# EasyEDA schematic KegWasher_1.1_Schematic.EasyEDA.json
TITLE: Keg Washer Pi Hat; REV: 1.1; Date: 2020-05-07; Sheet: 1/1; Drawn By: Kyle Hultman; Company: Kyle Hultman
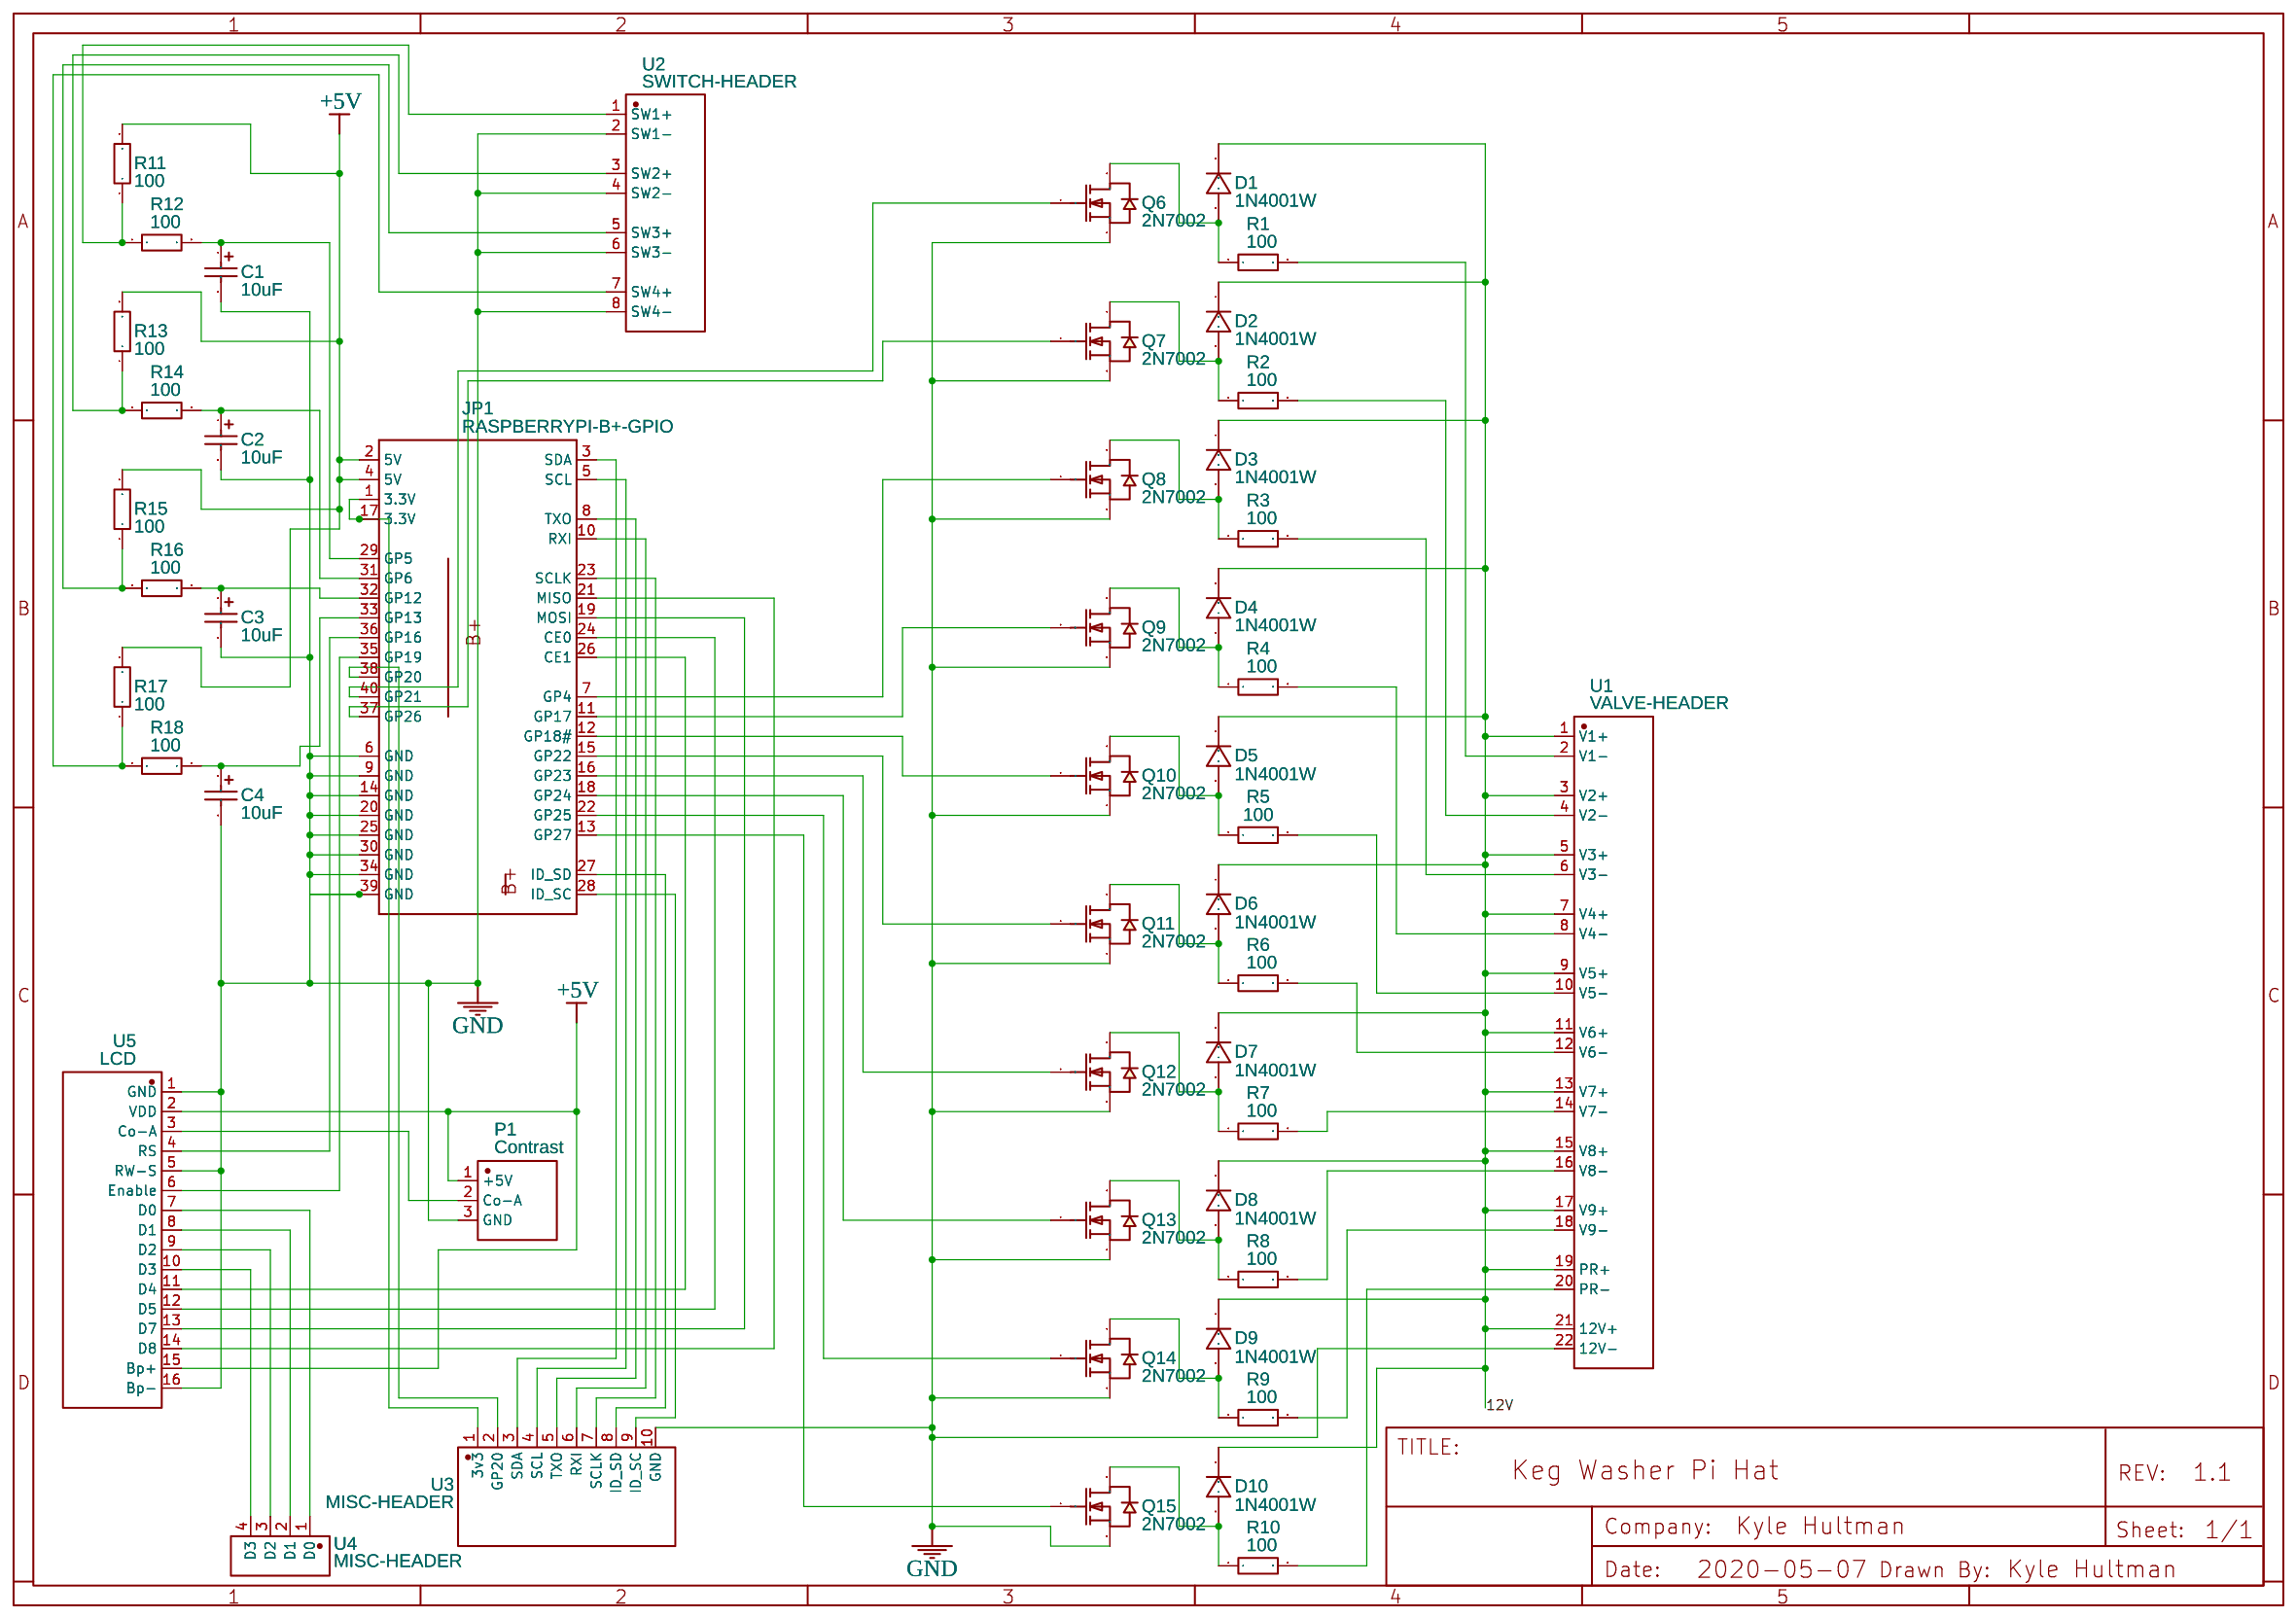
[diagram p0: schematic sheet]

## Parts
C1  10uF  [CAP-SMD_L3.2-W1.6-R-RD]
C2  10uF  [CAP-SMD_L3.2-W1.6-R-RD]
C3  10uF  [CAP-SMD_L3.2-W1.6-R-RD]
C4  10uF  [CAP-SMD_L3.2-W1.6-R-RD]
D1  1N4001W  [SOD-123F_L2.8-W1.8-LS3.7-RD]
D2  1N4001W  [SOD-123F_L2.8-W1.8-LS3.7-RD]
D3  1N4001W  [SOD-123F_L2.8-W1.8-LS3.7-RD]
D4  1N4001W  [SOD-123F_L2.8-W1.8-LS3.7-RD]
D5  1N4001W  [SOD-123F_L2.8-W1.8-LS3.7-RD]
D6  1N4001W  [SOD-123F_L2.8-W1.8-LS3.7-RD]
D7  1N4001W  [SOD-123F_L2.8-W1.8-LS3.7-RD]
D8  1N4001W  [SOD-123F_L2.8-W1.8-LS3.7-RD]
D9  1N4001W  [SOD-123F_L2.8-W1.8-LS3.7-RD]
D10  1N4001W  [SOD-123F_L2.8-W1.8-LS3.7-RD]
JP1  RASPBERRYPI-B+-GPIO  [2X20-SHROUDED]
P1  Contrast  [POTENTIOMETER_WIREPADS_SMALL]
Q6  2N7002  [SOT-23-3_L2.9-W1.3-P1.90-LS2.4-BR]
Q7  2N7002  [SOT-23-3_L2.9-W1.3-P1.90-LS2.4-BR]
Q8  2N7002  [SOT-23-3_L2.9-W1.3-P1.90-LS2.4-BR]
Q9  2N7002  [SOT-23-3_L2.9-W1.3-P1.90-LS2.4-BR]
Q10  2N7002  [SOT-23-3_L2.9-W1.3-P1.90-LS2.4-BR]
Q11  2N7002  [SOT-23-3_L2.9-W1.3-P1.90-LS2.4-BR]
Q12  2N7002  [SOT-23-3_L2.9-W1.3-P1.90-LS2.4-BR]
Q13  2N7002  [SOT-23-3_L2.9-W1.3-P1.90-LS2.4-BR]
Q14  2N7002  [SOT-23-3_L2.9-W1.3-P1.90-LS2.4-BR]
Q15  2N7002  [SOT-23-3_L2.9-W1.3-P1.90-LS2.4-BR]
R1  100  [R0805]
R2  100  [R0805]
R3  100  [R0805]
R4  100  [R0805]
R5  100  [R0805]
R6  100  [R0805]
R7  100  [R0805]
R8  100  [R0805]
R9  100  [R0805]
R10  100  [R0805]
R11  100  [R0805]
R12  100  [R0805]
R13  100  [R0805]
R14  100  [R0805]
R15  100  [R0805]
R16  100  [R0805]
R17  100  [R0805]
R18  100  [R0805]
U1  VALVE-HEADER  [PIN_HEADER_STRAIGHT_1X22_PITCH2.54MM]
U2  SWITCH-HEADER  [HDR-M-2.54_1X8]
U3  MISC-HEADER  [HDR-M-2.54_1X10]
U4  MISC-HEADER  [HDR-M-2.54_1X4]
U5  LCD  [HDR-M-2.54_1X16]

## Library data of the parts
C1-C4 = TAJA106K016RNJ: Supplier: LCSC; Manufacturer: AVX; LCSC Assembly: Yes; Supplier Part: C7171; SMT Type: Basic
D1-D10 = 1N4001W: Supplier Part: C162732; Supplier: LCSC; Manufacturer: Jingdao; Contributor: LCSC; LCSC Assembly: Yes; SMT Type: Extend
JP1 = RASPBERRYPI-B+-GPIO: Raspberry Pi B+ GPIO Header; Contributor: SparkFun
P1 = Contrast
Q6-Q15 = 2N7002: Supplier: LCSC; Manufacturer: CJ; LCSC Assembly: Yes; image: //image.lceda.cn/szlcsc/C8545.jpg; Supplier Part: C8545; SMT Type: Basic
R1-R18 = 0805W8F1000T5E: Supplier: LCSC; Manufacturer: UniOhm; LCSC Assembly: Yes; Supplier Part: C17408; SMT Type: Basic
U1 = VALVE-HEADER
U2 = SWITCH-HEADER
U3 U4 = MISC-HEADER
U5 = LCD

## Nets
12V: D1.1(C) D2.1(C) D3.1(C) D4.1(C) D5.1(C) D6.1(C) D7.1(C) D8.1(C) D9.1(C) D10.1(C) U1.1(V1+) U1.3(V2+) U1.5(V3+) U1.7(V4+) U1.9(V5+) U1.11(V6+) U1.13(V7+) U1.15(V8+) U1.17(V9+) U1.19(PR+) U1.21(12V+)
+5V: JP1.2(5V) JP1.4(5V) P1.1(+5V) R11.2 R13.2 R15.2 R17.2 U5.2(VDD) U5.15(Bp+)
GND: C1.2 C2.2 C3.2 C4.2 JP1.6(GND) JP1.9(GND) JP1.14(GND) JP1.20(GND) JP1.25(GND) JP1.30(GND) JP1.34(GND) JP1.39(GND) P1.3(GND) Q6.2(S) Q7.2(S) Q8.2(S) Q9.2(S) Q10.2(S) Q11.2(S) Q12.2(S) Q13.2(S) Q14.2(S) Q15.2(S) U1.22(12V-) U2.2(SW1-) U2.4(SW2-) U2.6(SW3-) U2.8(SW4-) U3.10(GND) U5.1(GND) U5.5(RW-S) U5.16(Bp-)
Net-(C1-1): C1.1 JP1.29(GP5) R12.2
Net-(C2-1): C2.1 JP1.31(GP6) R14.2
Net-(C3-1): C3.1 JP1.32(GP12) R16.2
Net-(C4-1): C4.1 JP1.33(GP13) R18.2
Net-(D1-2): D1.2(A) Q6.3(D) R1.1
Net-(D2-2): D2.2(A) Q7.3(D) R2.1
Net-(D3-2): D3.2(A) Q8.3(D) R3.1
Net-(D4-2): D4.2(A) Q9.3(D) R4.1
Net-(D5-2): D5.2(A) Q10.3(D) R5.1
Net-(D6-2): D6.2(A) Q11.3(D) R6.1
Net-(D7-2): D7.2(A) Q12.3(D) R7.1
Net-(D8-2): D8.2(A) Q13.3(D) R8.1
Net-(D9-2): D9.2(A) Q14.3(D) R9.1
Net-(D10-2): D10.2(A) Q15.3(D) R10.1
Net-(JP1-1): JP1.1(3.3V) JP1.17(3.3V) U3.1(3v3)
Net-(JP1-3): JP1.3(SDA) U3.3(SDA)
Net-(JP1-5): JP1.5(SCL) U3.4(SCL)
Net-(JP1-7): JP1.7(GP4) Q8.1(G)
Net-(JP1-8): JP1.8(TXO) U3.5(TXO)
Net-(JP1-10): JP1.10(RXI) U3.6(RXI)
Net-(JP1-11): JP1.11(GP17) Q9.1(G)
Net-(JP1-12): JP1.12(GP18#) Q10.1(G)
Net-(JP1-13): JP1.13(GP27) Q15.1(G)
Net-(JP1-15): JP1.15(GP22) Q11.1(G)
Net-(JP1-16): JP1.16(GP23) Q12.1(G)
Net-(JP1-18): JP1.18(GP24) Q13.1(G)
Net-(JP1-19): JP1.19(MOSI) U5.13(D7)
Net-(JP1-21): JP1.21(MISO) U5.14(D8)
Net-(JP1-22): JP1.22(GP25) Q14.1(G)
Net-(JP1-23): JP1.23(SCLK) U3.7(SCLK)
Net-(JP1-24): JP1.24(CE0) U5.12(D5)
Net-(JP1-26): JP1.26(CE1) U5.11(D4)
Net-(JP1-27): JP1.27(ID_SD) U3.8(ID_SD)
Net-(JP1-28): JP1.28(ID_SC) U3.9(ID_SC)
Net-(JP1-35): JP1.35(GP19) U5.6(Enable)
Net-(JP1-36): JP1.36(GP16) U5.4(RS)
Net-(JP1-37): JP1.37(GP26) Q7.1(G)
Net-(JP1-38): JP1.38(GP20) U3.2(GP20)
Net-(JP1-40): JP1.40(GP21) Q6.1(G)
Net-(P1-2): P1.2(Co-A) U5.3(Co-A)
Net-(R1-2): R1.2 U1.2(V1-)
Net-(R2-2): R2.2 U1.4(V2-)
Net-(R3-2): R3.2 U1.6(V3-)
Net-(R4-2): R4.2 U1.8(V4-)
Net-(R5-2): R5.2 U1.10(V5-)
Net-(R6-2): R6.2 U1.12(V6-)
Net-(R7-2): R7.2 U1.14(V7-)
Net-(R8-2): R8.2 U1.16(V8-)
Net-(R9-2): R9.2 U1.18(V9-)
Net-(R10-2): R10.2 U1.20(PR-)
Net-(R11-1): R11.1 R12.1 U2.1(SW1+)
Net-(R13-1): R13.1 R14.1 U2.3(SW2+)
Net-(R15-1): R15.1 R16.1 U2.5(SW3+)
Net-(R17-1): R17.1 R18.1 U2.7(SW4+)
Net-(U4-1): U4.1(D0) U5.7(D0)
Net-(U4-2): U4.2(D1) U5.8(D1)
Net-(U4-3): U4.3(D2) U5.9(D2)
Net-(U4-4): U4.4(D3) U5.10(D3)
